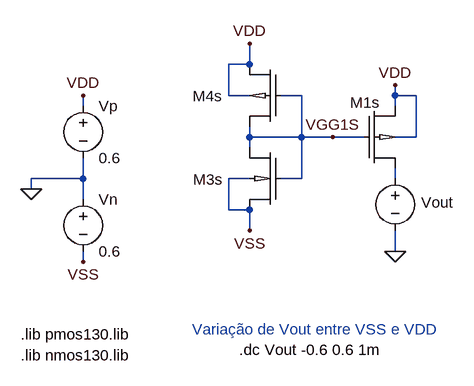
[diagram p0: schematic FiguraA_Questao5.asc]
FiguraA_Questao5.asc, the LTspice schematic file:
Version 4.1
SHEET 1 968 680
WIRE 112 -224 112 -256
WIRE 112 -224 80 -224
WIRE 80 -176 80 -224
WIRE 112 -176 80 -176
WIRE 192 -176 160 -176
WIRE 336 -176 336 -192
WIRE 368 -176 336 -176
WIRE -144 -160 -144 -176
WIRE 336 -160 336 -176
WIRE 112 -112 112 -128
WIRE 192 -112 192 -176
WIRE 192 -112 112 -112
WIRE 240 -112 192 -112
WIRE 288 -112 240 -112
WIRE 368 -112 368 -176
WIRE 368 -112 336 -112
WIRE 112 -96 112 -112
WIRE -144 -48 -144 -80
WIRE -144 -48 -224 -48
WIRE 112 -48 80 -48
WIRE 192 -48 192 -112
WIRE 192 -48 160 -48
WIRE 336 -48 336 -64
WIRE -224 -32 -224 -48
WIRE -144 -16 -144 -48
WIRE 80 0 80 -48
WIRE 112 0 80 0
WIRE 112 32 112 0
WIRE 336 64 336 32
WIRE -144 80 -144 64
FLAG -224 -32 0
FLAG -144 80 VSS
FLAG -144 -176 VDD
FLAG 336 -192 VDD
FLAG 336 64 0
FLAG 112 -256 VDD
FLAG 112 32 VSS
FLAG 240 -112 VGG1S
SYMBOL pmos130 288 -160 R0
WINDOW 0 -21 -5 Left 2
WINDOW 3 -99 27 Invisible 2
SYMATTR InstName M1s
SYMATTR SpiceLine width=3462n length=300n
SYMBOL voltage -144 -176 R0
WINDOW 123 0 0 Left 0
WINDOW 39 0 0 Left 0
SYMATTR InstName Vp
SYMATTR Value 0.6
SYMBOL voltage -144 -32 R0
WINDOW 123 0 0 Left 0
WINDOW 39 0 0 Left 0
SYMATTR InstName Vn
SYMATTR Value 0.6
SYMBOL voltage 336 -64 R0
WINDOW 0 40 53 Left 2
WINDOW 3 24 96 Invisible 2
WINDOW 123 0 0 Left 0
WINDOW 39 0 0 Left 0
SYMATTR InstName Vout
SYMATTR Value 0.6
SYMBOL nmos130 160 -96 M0
WINDOW 0 89 49 Left 2
WINDOW 3 56 72 Invisible 2
SYMATTR InstName M3s
SYMATTR SpiceLine width=600n length=8376n
SYMBOL pmos130 160 -128 R180
WINDOW 0 90 47 Left 2
WINDOW 3 56 72 Invisible 2
SYMATTR InstName M4s
SYMATTR SpiceLine width=945n length=403n
TEXT -240 192 Left 2 !.lib pmos130.lib
TEXT 96 216 Left 2 !.dc Vout -0.6 0.6 1m
TEXT 24 184 Left 2 ;Variação de Vout entre VSS e VDD
TEXT -240 224 Left 2 !.lib nmos130.lib

The netlist it stands for:
* FiguraA_Questao5.asc
X§M1s VDD VGG1S N001 VDD pmos130 width=3462n length=300n  ; pins D G S B
Vp VDD 0 0.6
Vn 0 VSS 0.6
Vout N001 0 0.6
X§M3s VGG1S VGG1S VSS VSS nmos130 width=600n length=8376n  ; pins D G S B
X§M4s VGG1S VGG1S VDD VDD pmos130 width=945n length=403n  ; pins D G S B
.lib pmos130.lib
.dc Vout -0.6 0.6 1m
* Variação de Vout entre VSS e VDD
.lib nmos130.lib
.backanno
.end